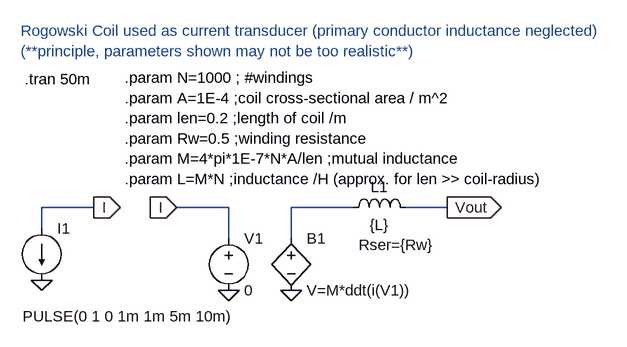
[diagram p0: schematic Rogowski_Coil.asc]
Rogowski_Coil.asc, the LTspice schematic file:
Version 4
SHEET 1 880 680
WIRE -272 208 -272 176
WIRE -192 176 -272 176
WIRE 16 176 -64 176
WIRE 16 224 16 176
WIRE 112 224 112 176
WIRE 208 176 112 176
WIRE 352 176 288 176
FLAG 112 304 0
FLAG 352 176 Vout
IOPIN 352 176 Out
FLAG 16 304 0
FLAG -64 176 I
IOPIN -64 176 In
FLAG -272 288 0
FLAG -192 176 I
IOPIN -192 176 Out
SYMBOL bv 112 208 R0
SYMATTR InstName B1
SYMATTR Value V=M*ddt(i(V1))
SYMBOL ind 192 192 R270
WINDOW 0 32 56 VTop 0
WINDOW 3 5 56 VBottom 0
WINDOW 39 -26 82 VBottom 0
SYMATTR InstName L1
SYMATTR Value {L}
SYMATTR SpiceLine Rser={Rw}
SYMBOL voltage 16 208 R0
WINDOW 123 0 0 Left 0
WINDOW 39 0 0 Left 0
SYMATTR InstName V1
SYMATTR Value 0
SYMBOL current -272 208 R0
WINDOW 3 -29 136 Left 0
WINDOW 123 0 0 Left 0
WINDOW 39 0 0 Left 0
SYMATTR Value PULSE(0 1 0 1m 1m 5m 10m)
SYMATTR InstName I1
TEXT -144 -24 Left 0 !.param N=1000 ; #windings\n.param A=1E-4 ;coil cross-sectional area / m^2\n.param len=0.2 ;length of coil /m\n.param Rw=0.5 ;winding resistance\n.param M=4*pi*1E-7*N*A/len ;mutual inductance\n.param L=M*N ;inductance /H (approx. for len >> coil-radius)
TEXT -304 -96 Left 0 ;Rogowski Coil used as current transducer (primary conductor inductance neglected)\n(**principle, parameters shown may not be too realistic**)
TEXT -298 -22 Left 0 !.tran 50m

The netlist it stands for:
* Rogowski_Coil.asc
B1 N001 0 V=M*ddt(i(V1))
L1 N001 Vout {L} Rser={Rw}
V1 I 0 0
I1 I 0 PULSE(0 1 0 1m 1m 5m 10m)
.param N=1000 ; #windings
.param A=1E-4 ;coil cross-sectional area / m^2
.param len=0.2 ;length of coil /m
.param Rw=0.5 ;winding resistance
.param M=4*pi*1E-7*N*A/len ;mutual inductance
.param L=M*N ;inductance /H (approx. for len >> coil-radius)
* Rogowski Coil used as current transducer (primary conductor inductance neglected)
* (**principle, parameters shown may not be too realistic**)
.tran 50m
.backanno
.end